# Altium schematic sheet Amp_Stage.SchDoc
size A
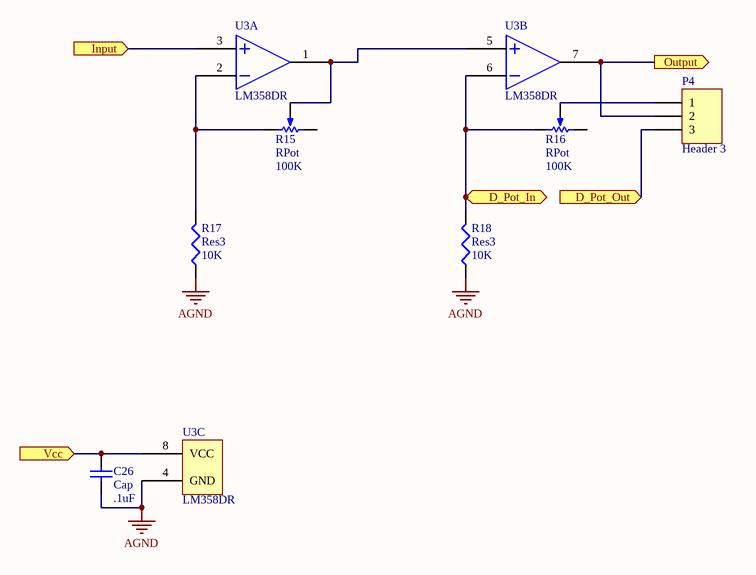
[diagram p0: Amp_Stage.SchDoc]

## Parts
C26  Cap  value .1uF  [1608[0603]]
P4  Header 3  [HDR1X3]
R15  RPot  value 100K  [VR5]
R16  RPot  value 100K  [VR5]
R17  Res3  value 10K  [J1-0603]
R18  Res3  value 10K  [J1-0603]
U3  LM358DR  [SOIC127P600X175-8N(lm358)]  (parts A,B,C of 3)

## Ports
D_Pot_In (in), D_Pot_Out (in), Input (in), Output (out), Vcc (in)

## Nets
AGND: C26.1 R17.1 R18.1 U3.4(GND)
D_Pot_In: R16.2(BOT) R18.2 U3.6(2IN-) ; port D_Pot_In
D_Pot_Out: P4.3 ; port D_Pot_Out
Input: U3.3(1IN+) ; port Input
Output: P4.2 U3.7(2OUT) ; port Output
Vcc: C26.2 U3.8(VCC) ; port Vcc
NetP4_1: P4.1 R16.3(TAP)
NetR15_2: R15.2(BOT) R17.2 U3.2(1IN-)
NetR15_3: R15.3(TAP) U3.1(1OUT) U3.5(2IN+)

Not connected (* = marked no-connect by the designer): R15 1(TOP); R16 1(TOP)

## Library data of the parts
C26 = Cap: Capacitor; Published: 8-Jun-2000; LatestRevisionDate: 17-Jul-2002; LatestRevisionNote: Re-released for DXP Platform.; PackageReference: RAD-0.3; Publisher: Altium Limited; PackageDescription: Radial Cap, Thru-Hole; 2 Leads; 0.3 in Pin Spacing
P4 = Header 3: Header, 3-Pin; LatestRevisionDate: 17-Jul-2002; LatestRevisionNote: Re-released for DXP Platform.; Publisher: Altium Limited
R15 R16 = RPot: Potentiometer; Sim Note: Enter the Resistance value and the set point into parameter fields.; Set Position: 0.5; Published: 8-Jun-2000; LatestRevisionDate: 17-Jul-2002; LatestRevisionNote: Re-released for DXP Platform.; PackageReference: VR5; Publisher: Altium Limited; PackageDescription: Variable Resistor, Thru-Hole; 3 Leads
R17 R18 = Res3: Resistor; Published: 8-Jun-2000; LatestRevisionDate: 29-May-2009; LatestRevisionNote: IPC-7351 Footprint Added.; PackageReference: J1-0603; Publisher: Altium Limited; PackageDescription: Chip Resistor